# EAGLE design main (EAGLE 6.5.0)
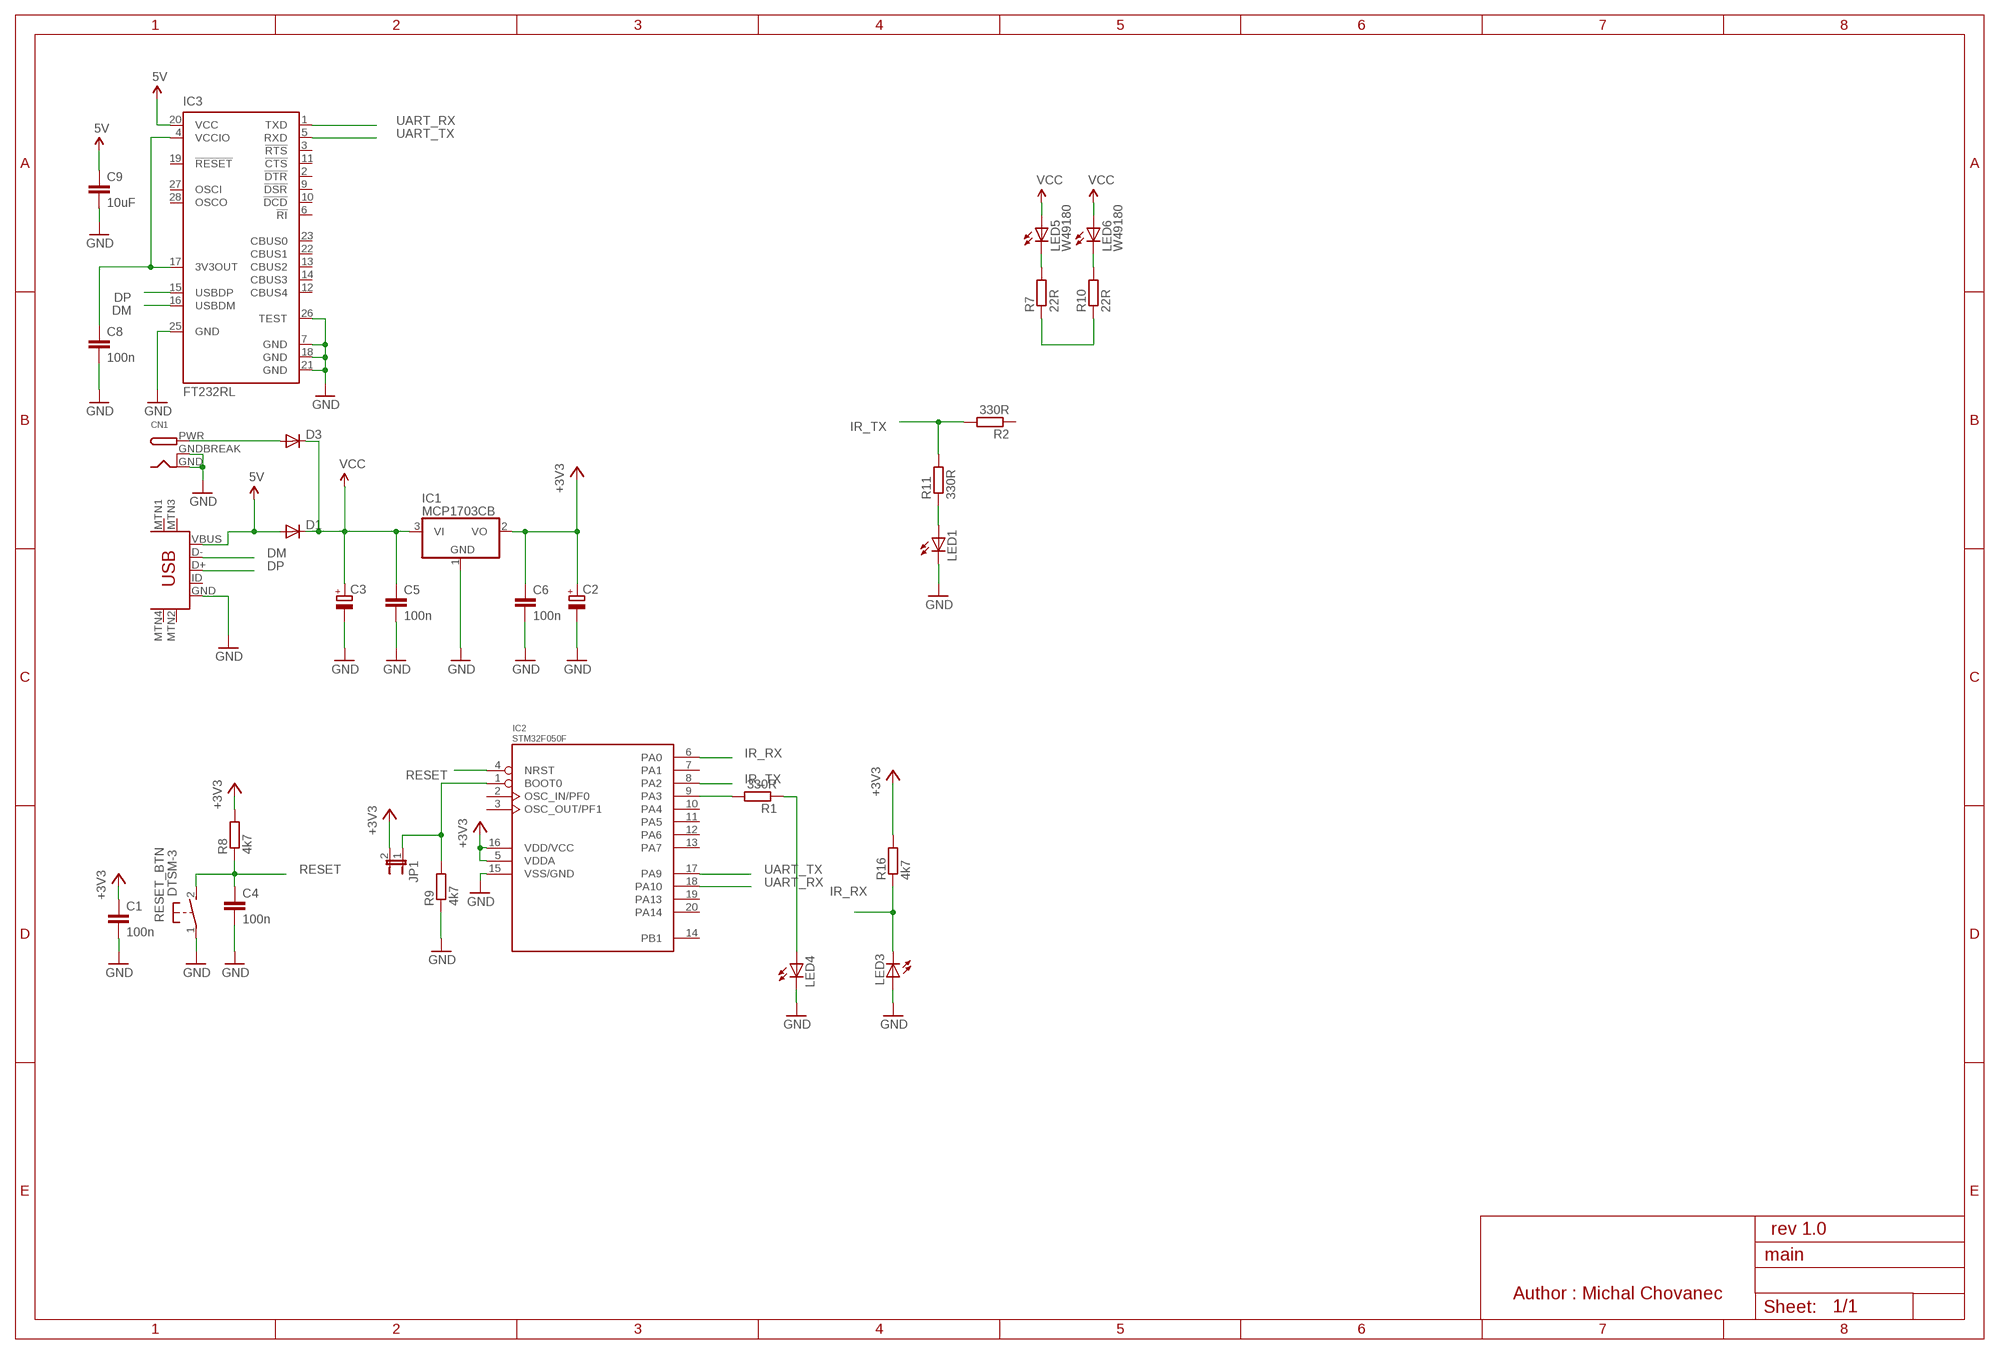
[diagram p0: schematic, sheet 1]

## Parts
C1  100n  C-EUC0805  [C0805]
C2  CPOL-EU153CLV-0405  [153CLV-0405]
C3  CPOL-EU150CLZ-1010  [150CLZ-1010]
C4  100n  C-EUC0805  [C0805]
C5  100n  C-EUC0805  [C0805]
C6  100n  C-EUC0805  [C0805]
C8  100n  C-EUC0805  [C0805]
C9  10uF  C-EUC0805  [C0805]
CN1  DCBARRELPTH  [DCJACK_2MM_PTH]
D1  DIODE-DO-214AC  [DO-214AC]
D3  DIODE-DO-214AC  [DO-214AC]
IC1  MCP1703CB  [SOT23]
IC2  STM32F050F  [TSSOP20]
IC3  FT232RL  [SSOP28]
JP1  JP1E  [JP1]
LED1  LEDCHIPLED_1206  [CHIPLED_1206]
LED3  LEDCHIPLED_1206  [CHIPLED_1206]
LED4  LEDCHIPLED_1206  [CHIPLED_1206]
LED5  W49180  [Z-POWER-LED-DOME-TYPE]
LED6  W49180  [Z-POWER-LED-DOME-TYPE]
R1  330R  R-EU_M0805  [M0805]
R2  330R  R-EU_M0805  [M0805]
R7  22R  R-EU_M0805  [M0805]
R8  4k7  R-EU_M0805  [M0805]
R9  4k7  R-EU_M0805  [M0805]
R10  22R  R-EU_M0805  [M0805]
R11  330R  R-EU_M0805  [M0805]
R16  4k7  R-EU_M0805  [M0805]
RESET_BTN  DTSM-3  [DTSM-3]
U$1  USB-MINIB-5PIN  [USB-MINIB]

## Nets
5V: C9.1 D1.A IC3.20(VCC) U$1.VBUS
+3V3: C1.1 C2.+ C6.1 IC1.2(VO) IC2.5(VDDA) IC2.16(VDD/VCC) JP1.2 R8.2 R16.2
BOOT: IC2.1(BOOT0) JP1.1 R9.2
DM: IC3.16(USBDM) U$1.D-
DP: IC3.15(USBDP) U$1.D+
GND: C1.2 C2.- C3.- C4.2 C5.2 C6.2 C8.2 C9.2 CN1.GND CN1.GNDBREAK IC1.1(GND) IC2.15(VSS/GND) IC3.7(GND) IC3.18(GND) IC3.21(GND) IC3.25(GND) IC3.26(TEST) LED1.C LED3.A LED4.C R9.1 RESET_BTN.1 U$1.GND
IR_RX: IC2.6(PA0) LED3.C R16.1
IR_TX: IC2.8(PA2) R2.2 R11.2
N$1: IC2.9(PA3) R1.2
N$2: C8.1 IC3.4(VCCIO) IC3.17(3V3OUT)
N$3: LED1.A R11.1
N$4: CN1.PWR D3.A
N$7: LED4.A R1.1
N$9: LED5.C R7.2
N$10: LED6.C R10.2
N$13: R7.1 R10.1
RESET: C4.1 IC2.4(NRST) R8.1 RESET_BTN.2
UART_RX: IC2.18(PA10) IC3.1(TXD)
UART_TX: IC2.17(PA9) IC3.5(RXD)
VCC: C3.+ C5.1 D1.C D3.C IC1.3(VI) LED5.A LED6.A
Unconnected: IC2.2(OSC_IN/PF0) IC2.3(OSC_OUT/PF1) IC2.7(PA1) IC2.10(PA4) IC2.11(PA5) IC2.12(PA6) IC2.13(PA7) IC2.14(PB1) IC2.19(PA13) IC2.20(PA14) IC3.2(!DTR) IC3.3(!RTS) IC3.6(!RI) IC3.9(!DSR) IC3.10(!DCD) IC3.11(!CTS) IC3.12(CBUS4) IC3.13(CBUS2) IC3.14(CBUS3) IC3.19(!RESET) IC3.22(CBUS1) IC3.23(CBUS0) IC3.27(OSCI) IC3.28(OSCO) R2.1 U$1.ID U$1.MTN1(MTN2) U$1.MTN2(MTN3) U$1.MTN3(MTN1) U$1.MTN4

## Notes on the sheet
- rev 1.0
- Author : Michal Chovanec

## Library data of the parts
C1 C4-C6 C8 C9 = resistor:C-EU: CAPACITOR, European symbol
C2 = resistor:CPOL-EU: POLARIZED CAPACITOR, European symbol
C3 = my_parts:CPOL-EU: POLARIZED CAPACITOR, European symbol
CN1 = adafruit:DCBARREL: 2.0mm DC Barrel Jack DCJACK_2MM_PTH - Through Hole Jack (4UConnector: 05537)
D1 D3 = diode:DIODE-: DIODE
IC1 = linear:MCP1703: 250 mA, 16V, Low Quiescent Current LDO Regulator Source: http://ww1.microchip.com/downloads/en/DeviceDoc/22049b.pdf
IC2 = STM32F050:STM32F050*: STM32F050xxF*
IC3 = ftdichip:FT232R: Source: http://www.ftdichip.com/Documents/DataSheets/DS_FT232R_v104.pdf; MPN: FT232RL; OC_FARNELL: 1146032; OC_NEWARK: 91K9918
JP1 = jumper:JP1E: JUMPER
LED1 LED3 LED4 = led:LED: LED OSRAM: - CHIPLED LG R971, LG N971, LY N971, LG Q971, LY Q971, LO R971, LY R971 LH N974, LH R974 LS Q976, LO Q976, LY Q976 LO Q996 - Hyper CHIPLED LW Q18S LB Q993, LB Q99A, LB R99A - SideLED LS A670, LO A670, LY A670, LG A670, LP A670 LB A673, LV A673, LT A673, LW A673 LH A674 LY A675 LS A676, LA A676, LO A676, LY A676, LW A676 LS A679, LY A679, LG A679 - Hyper Micro SIDELED® LS Y876, LA Y876, LO Y876, LY Y876 LT Y87S - SmartLED LW L88C, LW L88S LB L89C, LB L89S, LG L890 LS L89K, LO L89K, LY L89K LS L896, LA L896, LO L896, LY L896 - TOPLED LS T670, LO T670, LY T670, LG T670, LP T670 LSG T670, LSP T670, LSY T670, LOP T670, LYG T670 LG T671, LOG T671, LSG T671 LB T673, LV T673, LT T673, LW T673 LH T674 LS T676, LA T676, LO T676, LY T676, LB T676, LH T676, LSB T676, LW T676 LB T67C, LV T67C, LT T67C, LS T67K, LO T67K, LY T67K, LW E67C LS E67B, LA E67B, LO E67B, LY E67B, LB E67C, LV E67C, LT E67C LW T67C LS T679, LY T679, LG T679 LS T770, LO T770, LY T770, LG T770, LP T770 LB T773, LV T773, LT T773, LW T773 LH T774 LS E675, LA E675, LY E675, LS T675 LS T776, LA T776, LO T776, LY T776, LB T776 LHGB T686 LT T68C, LB T68C - Hyper Mini TOPLED® LB M676 - Mini TOPLED Santana® LG M470 LS M47K, LO M47K, LY M47K Source: http://www.osram.convergy.de LUXEON: - LUMILED® LXK2-PW12-R00, LXK2-PW12-S00, LXK2-PW14-U00, LXK2-PW14-V00 LXK2-PM12-R00, LXK2-PM12-S00, LXK2-PM14-U00 LXK2-PE12-Q00, LXK2-PE12-R00, LXK2-PE12-S00, LXK2-PE14-T00, LXK2-PE14-U00 LXK2-PB12-K00, LXK2-PB12-L00, LXK2-PB12-M00, LXK2-PB14-N00, LXK2-PB14-P00, LXK2-PB14-Q00 LXK2-PR12-L00, LXK2-PR12-M00, LXK2-PR14-Q00, LXK2-PR14-R00 LXK2-PD12-Q00, LXK2-PD12-R00, LXK2-PD12-S00 LXK2-PH12-R00, LXK2-PH12-S00 LXK2-PL12-P00, LXK2-PL12-Q00, LXK2-PL12-R00 Source: www.luxeon.com KINGBRIGHT: KA-3528ASYC Source: www.kingbright.com
LED5 LED6 = led:W49180: Z-Power LED P4 Series, Dome type Source: http://www.acriche.com .. W49180.pdf
R1 R2 R7-R11 R16 = resistor:R-EU_: RESISTOR, European symbol
RESET_BTN = switch-tact:DTSM-3
U$1 = SparkFun:USB-MINIB: Mini-USB "B" connector with 5th pin broken out. Created new symbol breaking out 5th "ID" pin in mini/micro USB connector spec. See: http://en.wikipedia.org/wiki/Mini_usb#Cables. Uses same footprint as 4-pin symbol. Also added pins to connect to mounting / shield pads if required (probably not generally needed as signals aren't shielded once they leave the connector).

## Board
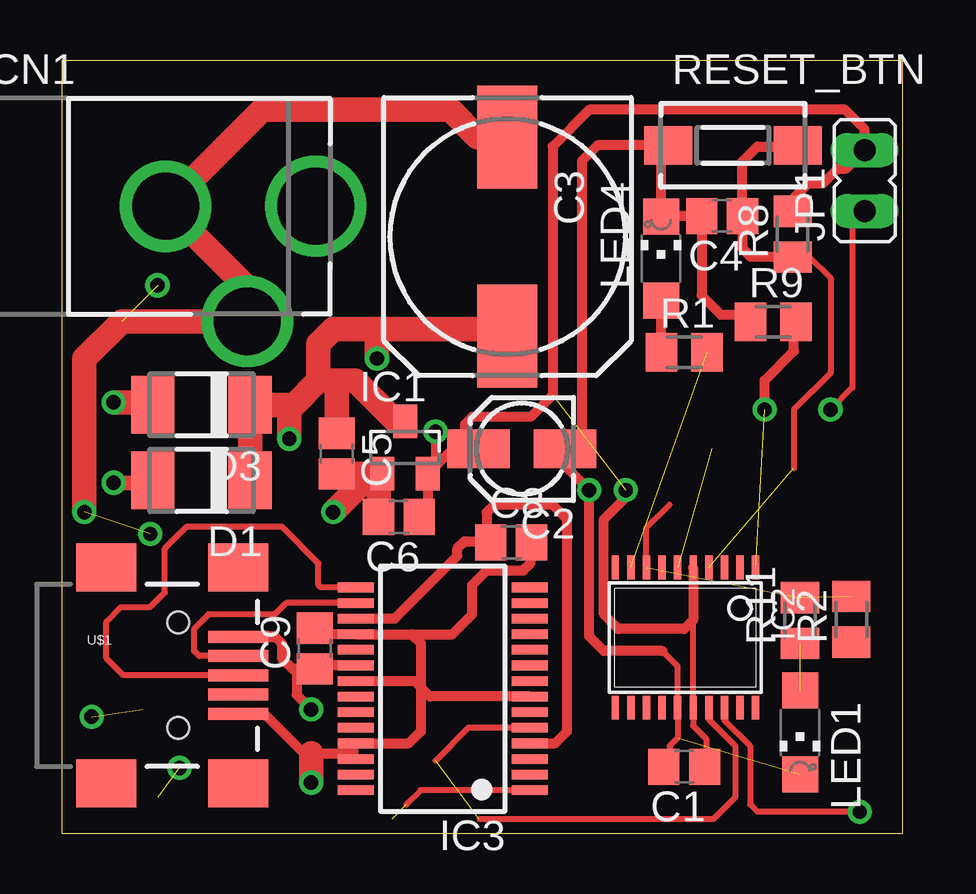
[diagram p1: board, top side]
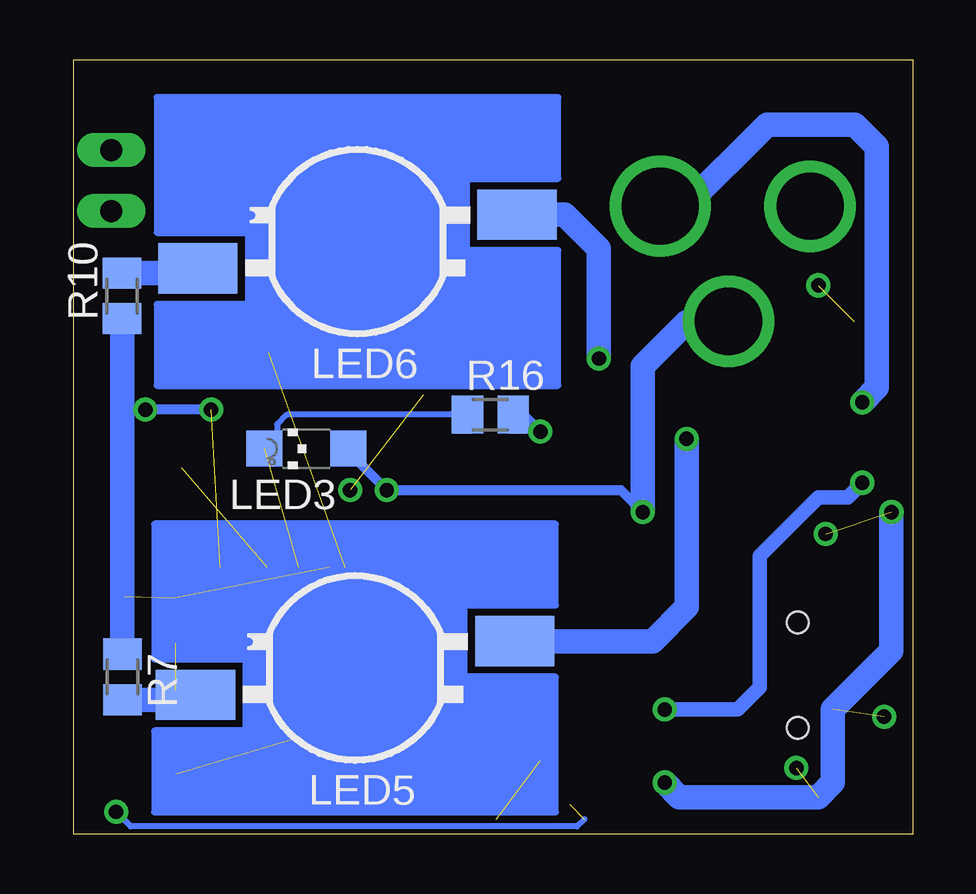
[diagram p2: board, bottom side, seen from below]

Size 35 x 32.26 mm. Coordinates in mm from the lower left corner, seen from the top.
Outline: 0,32.26 35,32.26 35,0 0,0 0,32.26
Copper layers (1*16): Top 0.035mm / dielectric 1.5mm / Bottom 0.035mm
Design rules "default": minimum track width 10mil, minimum drill 24mil, track to track 8mil, track to pad 8mil, pad to pad 8mil, via to via 8mil, smd to smd 8mil, copper to edge 40mil, drill to drill 8mil, minimum pad ring 10mil, minimum via ring 8mil, stop-mask expansion 4mil, vias tented up to drill 0mil, thermal gap 10mil

### Footprints (pad centres in the part's own frame; a part is rotated, then mirrored left to right if it is on the bottom)
C0805 = smd 1.3 x 1.5: 1 -0.85,0; 2 0.85,0
153CLV-0405 = smd 2.6 x 1.6: + 1.8,0; - -1.8,0
150CLZ-1010 = smd 4.3 x 2.5: + 4.15,0; - -4.15,0
DCJACK_2MM_PTH = drill 2.8: GND 0,7.35; GNDBREAK 4.8,10.75 | drill 3.2: PWR 0,13.6
DO-214AC = smd 1.8 x 2.4: A 2.025,0; C -2.025,0
SOT23 = smd 1 x 1.4: 1 -0.95,-1.1; 2 0.95,-1.1; 3 0,1.1
TSSOP20 = smd 0.305 x 0.991: 1 -2.925,-2.918; 2 -2.275,-2.918; 3 -1.625,-2.918; 4 -0.975,-2.918; 5 -0.325,-2.918; 6 0.325,-2.918; 7 0.975,-2.918; 8 1.625,-2.918; 9 2.275,-2.918; 10 2.925,-2.918; 11 2.925,2.918; 12 2.275,2.918; 13 1.625,2.918; 14 0.975,2.918; 15 0.325,2.918; 16 -0.325,2.918; 17 -0.975,2.918; 18 -1.625,2.918; 19 -2.275,2.918; 20 -2.925,2.918
SSOP28 = smd 0.4 x 1.5: 1 -4.225,-3.625; 2 -3.575,-3.625; 3 -2.925,-3.625; 4 -2.275,-3.625; 5 -1.625,-3.625; 6 -0.975,-3.625; 7 -0.325,-3.625; 8 0.325,-3.625; 9 0.975,-3.625; 10 1.625,-3.625; 11 2.275,-3.625; 12 2.925,-3.625; 13 3.575,-3.625; 14 4.225,-3.625; 15 4.225,3.625; 16 3.575,3.625; 17 2.925,3.625; 18 2.275,3.625; 19 1.625,3.625; 20 0.975,3.625; 21 0.325,3.625; 22 -0.325,3.625; 23 -0.975,3.625; 24 -1.625,3.625; 25 -2.275,3.625; 26 -2.925,3.625; 27 -3.575,3.625; 28 -4.225,3.625
JP1 = drill 0.914 long: 1 0,-1.27; 2 0,1.27
CHIPLED_1206 = smd 1.5 x 1.5: A 0,-1.75; C 0,1.75
Z-POWER-LED-DOME-TYPE = smd 3.3 x 2.1: A -6.65,-1.12; C 6.65,1.12
M0805 = smd 1.3 x 1.6: 1 -0.95,0; 2 0.95,0
DTSM-3 = smd 2 x 1.6: 1 -2.7,0; 2 2.7,0
USB-MINIB = smd 2.5 x 0.5: D+ 2.5,0; D- 2.5,0.8; GND 2.5,-1.6; ID 2.5,-0.8; VBUS 2.5,1.6 | smd 2.5 x 2: MTN1 -3,4.5; MTN2 2.5,4.5; MTN3 -3,-4.5; MTN4 2.5,-4.5 | hole 0.9: 0,2.2; 0,-2.2

### Placement (x,y rotation side)
C1  25.91,2.79 180 top
C2  19.14,16.04 180 top
C3  18.54,24.89 270 top
C4  27.48,25.76 180 top
C5  11.43,15.85 270 top
C6  14.02,13.21 180 top
C8  18.69,12.14 0 top
C9  10.52,7.72 90 top
CN1  -3.05,26.16 270 top
D1  5.79,14.73 180 top
D3  5.79,17.88 180 top
IC1  14.27,16.1 0 top
IC2  25.96,8.18 180 top
IC3  15.85,6.05 90 top
JP1  33.43,27.23 0 top
LED1  30.73,4.22 180 top
LED3  25.3,16.05 90 bottom
LED4  24.94,23.98 0 top
LED5  23.27,6.91 180 bottom
LED6  23.16,24.69 180 bottom
R1  25.91,20.07 0 top
R2  32.87,8.94 90 top
R7  32.96,6.53 270 bottom
R8  30.43,24.99 90 top
R9  29.62,21.34 0 top
R10  32.97,22.42 90 bottom
R11  30.73,8.89 90 top
R16  17.63,17.48 0 bottom
RESET_BTN  27.94,28.7 0 top
U$1  4.83,6.6 0 top

### Tracks (layer width: path | path; a pad name or v marks a point on that pad's centre or on a via)
5V  (via drill 0.6)
  Top 0.406: IC3.20 10.66,7.02 C9.1 9.59,6.87 | 9.59,6.87 9.14,7.32 9.14,7.92 8.87,8.2 | 8.87,8.2 8.84,8.23 7.35,8.23 U$1.VBUS 8.87,8.2 | 9.59,6.87 9.75,6.71 9.75,5.79 v10.36,5.18
  Top 0.61: v2.13,14.63 3.67,14.63 D1.A
  Bottom 0.61: v10.36,5.18 7.32,5.18 6.4,6.1 6.4,11.58 3.96,14.02 2.74,14.02 v2.13,14.63
+3V3  (via drill 0.6)  (1 unrouted)
  Top 0.254: C1.1 26.82,2.86 26.82,3.96 26.28,4.5 IC2.16 IC2.5
  Top 0.406: IC1.2 15.22,13.56 C6.1 | C2.+ 16.76,16.04 | 16.76,16.04 16.26,16.04 IC1.2 | R8.2 30.43,26.47 31.09,27.13 31.7,27.13 32.31,27.74 32.66,27.74 JP1.2 33.43,29.36 32.61,30.18 21.95,30.18 20.42,28.65 20.42,18.29 19.51,17.37 17.07,17.37 16.76,17.07 16.76,16.04 | IC2.5 26.28,8.91 25.91,8.53 23.16,8.53 22.55,9.14 22.55,13.11 23.47,14.02 v23.47,14.33 | v15.54,16.76 15.54,15.32 IC1.2
  Bottom 0.406: R16.2 16.26,17.48 v15.54,16.76
BOOT  (via drill 0.6)  (1 unrouted)
  Top 0.254: 32.92,25.45 32.92,18.59 v32,17.68
  Top 0.406: 32.92,25.45 JP1.1 | v29.26,17.68 29.26,18.9 30.48,20.12 30.48,21.25 R9.2
  Bottom 0.406: v29.26,17.68 v32,17.68
DM
  Top 0.254: U$1.D- 5.7,7.4 5.49,7.62 5.49,8.53 6.1,9.14 8.84,9.14 9.31,9.62 IC3.16
DP
  Top 0.254: U$1.D+ 2.54,6.6 1.83,7.32 1.83,8.84 2.44,9.45 3.66,9.45 4.27,10.06 4.27,11.89 5.18,12.8 9.14,12.8 10.67,11.28 10.67,10.36 10.76,10.27 IC3.15
GND  (via drill 0.6)  (5 unrouted)
  Top 0.254: IC3.26 IC3.25 | C1.2 25.3,3.03 25.3,3.66 25.63,3.99 IC2.15 25.63,6.98 24.99,7.62
  Top 0.406: U$1.GND 8.41,5 10.06,3.35 10.36,3.35 11.99,3.35 IC3.26 | IC3.25 14.44,3.77 14.94,4.27 14.94,6.1 | 14.54,8.32 IC3.18 10.77,8.32 C9.2 | 14.54,8.32 14.94,7.92 14.94,6.1 | IC3.21 14.66,6.37 14.94,6.1 | IC3.7 15.31,5.72 14.94,6.1 | 14.54,8.32 16.25,8.32 17.07,9.14 17.07,10.36 17.68,10.97 19.2,10.97 19.51,11.28 19.51,12.1 C8.2 | C2.- 20.94,15.33 v21.95,14.33 21.95,8.23 22.55,7.62 24.99,7.62 | 21.03,16.13 C2.- | C2.- 21.64,16.74 21.64,28.04 22.3,28.7 RESET_BTN.1 24.94,28.41 LED4.C 24.97,25.76 C4.2 26.63,22.44 27.43,21.64 28.36,21.64 R9.1
  Top 1.016: C3.- 17.29,29.04 16.15,30.18 8.31,30.18 CN1.GND 7.7,22.76 CN1.GNDBREAK 2.46,21.36 0.91,19.81 v0.91,13.41 | v10.36,2.13 10.36,3.35 | IC1.1 C5.2 | IC1.1 12.87,15 v11.28,13.41 | C6.2 13.17,14.85 IC1.1
  Bottom 0.406: v11.28,13.41 12.19,14.33 v21.95,14.33 23.55,15.93 LED3.A
  Bottom 1.016: v0.91,13.41 0.91,7.62 3.35,5.18 3.35,2.13 3.96,1.52 9.75,1.52 v10.36,2.13 | v11.28,13.41 11.28,19.51 9.45,21.34 7.73,21.34 CN1.GNDBREAK
  other vias: 3.66,12.5 1.22,4.88 4.88,2.74 3.96,22.86
IR_RX  (1 unrouted)
  Bottom 0.254: R16.1 26.11,17.48 26.52,17.07 26.52,16.58 LED3.C
  Bottom 0.406: 27.13,16.13 LED3.C
IR_TX  (2 unrouted)
  Top 0.254: IC2.8 24.33,12.75 25.3,13.72
N$1  (1 unrouted)
N$2
  Top 0.406: IC3.17 13.85,8.97 16.46,11.58 16.46,11.89 16.76,12.19 17.79,12.19 C8.1 17.68,12.31 17.68,13.41 17.98,13.72 20.42,13.72 21.03,13.11 21.03,4.27 20.53,3.77 IC3.4
N$3  (1 unrouted)
N$4  (via drill 0.6)
  Top 1.016: v2.13,17.98 3.67,17.98 D3.A
  Bottom 1.016: CN1.PWR 9.5,26.16 6.1,29.57 2.44,29.57 1.52,28.65 1.52,18.59 v2.13,17.98
N$7
  Top 0.406: R1.1 24.96,22.21 LED4.A
N$9
  Bottom 1.016: R7.2 30.12,5.58 LED5.C
N$10
  Bottom 1.016: R10.2 30.01,23.37 LED6.C
N$13
  Bottom 1.016: R7.1 R10.1
RESET  (1 unrouted)
  Top 0.254: R8.1 31.12,24.04 32,23.16 32,19.2 30.48,17.68 30.48,15.24
  Top 0.406: RESET_BTN.2 30.59,28.65 28.96,28.65 28.33,28.03 C4.1 28.35,25.74 28.35,24.38 28.69,24.04 R8.1
UART_RX  (via drill 0.6)  (1 unrouted)
  Top 0.254: IC2.18 27.58,4.72 28.65,3.66 28.65,1.22 28.96,0.91 v33.22,0.91 | IC3.1 14.93,1.82 14.33,1.22
  Bottom 0.254: 13.72,0.61 14.02,0.3 32.61,0.3 v33.22,0.91
UART_TX  (1 unrouted)
  Top 0.254: IC2.17 26.93,4.76 28.04,3.66 28.04,1.52 27.13,0.61 17.37,0.61 | IC3.5 16.92,4.42 15.54,3.05
VCC  (via drill 0.6)
  Top 1.016: D1.C D3.C 9.45,17.88 | 9.45,17.88 9.65,17.88 10.67,18.9 | 10.67,18.9 10.67,20.42 11.28,21.03 13.11,21.03 | 13.11,21.03 18.25,21.03 C3.+ | v13.11,19.81 13.11,21.03 | v9.45,16.46 9.45,17.88 | IC1.3 13.89,17.2 12.19,18.9 11.58,18.9 | 11.58,18.9 10.67,18.9 | C5.1 11.43,18.75 11.58,18.9
  Bottom 1.016: LED6.A 14.53,25.81 13.11,24.38 v13.11,19.81 | LED5.A 10.87,8.03 9.45,9.45 v9.45,16.46